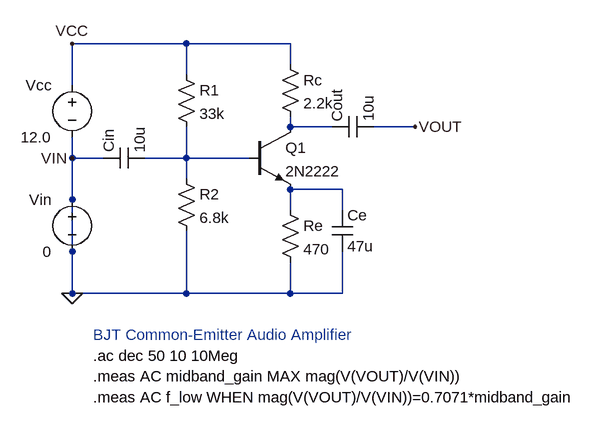
[diagram p0: schematic bjt_amplifier.asc]
bjt_amplifier.asc, the LTspice schematic file:
Version 4
SHEET 1 1000 700
WIRE 48 160 48 96
WIRE 48 96 384 96
WIRE 48 240 48 480
WIRE 224 96 224 144
WIRE 224 224 224 272
WIRE 224 272 224 304
WIRE 224 384 224 480
WIRE 224 272 320 272
WIRE 384 96 384 128
WIRE 384 208 384 224
WIRE 384 320 384 352
WIRE 384 432 384 480
WIRE 384 320 464 320
WIRE 464 320 464 352
WIRE 464 416 464 480
WIRE 48 336 48 272
WIRE 48 272 96 272
WIRE 48 416 48 480
WIRE 160 272 224 272
WIRE 384 224 448 224
WIRE 512 224 576 224
WIRE 48 480 464 480
FLAG 48 96 VCC
FLAG 48 272 VIN
FLAG 576 224 VOUT
FLAG 48 480 0
SYMBOL voltage 48 144 R0
WINDOW 0 -32 16 Right 2
WINDOW 3 -32 96 Right 2
SYMATTR InstName Vcc
SYMATTR Value 12.0
SYMBOL res 208 128 R0
SYMATTR InstName R1
SYMATTR Value 33k
SYMBOL res 208 288 R0
SYMATTR InstName R2
SYMATTR Value 6.8k
SYMBOL npn 320 224 R0
SYMATTR InstName Q1
SYMATTR Value 2N2222
SYMBOL res 368 112 R0
SYMATTR InstName Rc
SYMATTR Value 2.2k
SYMBOL res 368 336 R0
SYMATTR InstName Re
SYMATTR Value 470
SYMBOL cap 448 352 R0
SYMATTR InstName Ce
SYMATTR Value 47u
SYMBOL voltage 48 320 R0
WINDOW 0 -32 16 Right 2
WINDOW 3 -32 96 Right 2
SYMATTR InstName Vin
SYMATTR Value 0
SYMATTR Value2 AC 10m
SYMBOL cap 96 288 R270
SYMATTR InstName Cin
SYMATTR Value 10u
SYMBOL cap 448 240 R270
SYMATTR InstName Cout
SYMATTR Value 10u
TEXT 80 544 Left 2 ;BJT Common-Emitter Audio Amplifier
TEXT 80 576 Left 2 !.ac dec 50 10 10Meg
TEXT 80 608 Left 2 !.meas AC midband_gain MAX mag(V(VOUT)/V(VIN))
TEXT 80 640 Left 2 !.meas AC f_low WHEN mag(V(VOUT)/V(VIN))=0.7071*midband_gain

The netlist it stands for:
* bjt_amplifier.asc
Vcc VCC 0 12.0
R1 VCC N001 33k
R2 N001 0 6.8k
Q1 N002 N001 N003 0 2N2222
Rc VCC N002 2.2k
Re N003 0 470
Ce N003 0 47u
Vin 0 0 0 AC 10m
Cin 0 N001 10u
Cout N002 VOUT 10u
.model NPN NPN
.model PNP PNP
.lib standard.bjt
* BJT Common-Emitter Audio Amplifier
.ac dec 50 10 10Meg
.meas AC midband_gain MAX mag(V(VOUT)/V(VIN))
.meas AC f_low WHEN mag(V(VOUT)/V(VIN))=0.7071*midband_gain
.backanno
.end